# EAGLE design wt12_breakout_board_v30 (EAGLE 7.5.0)
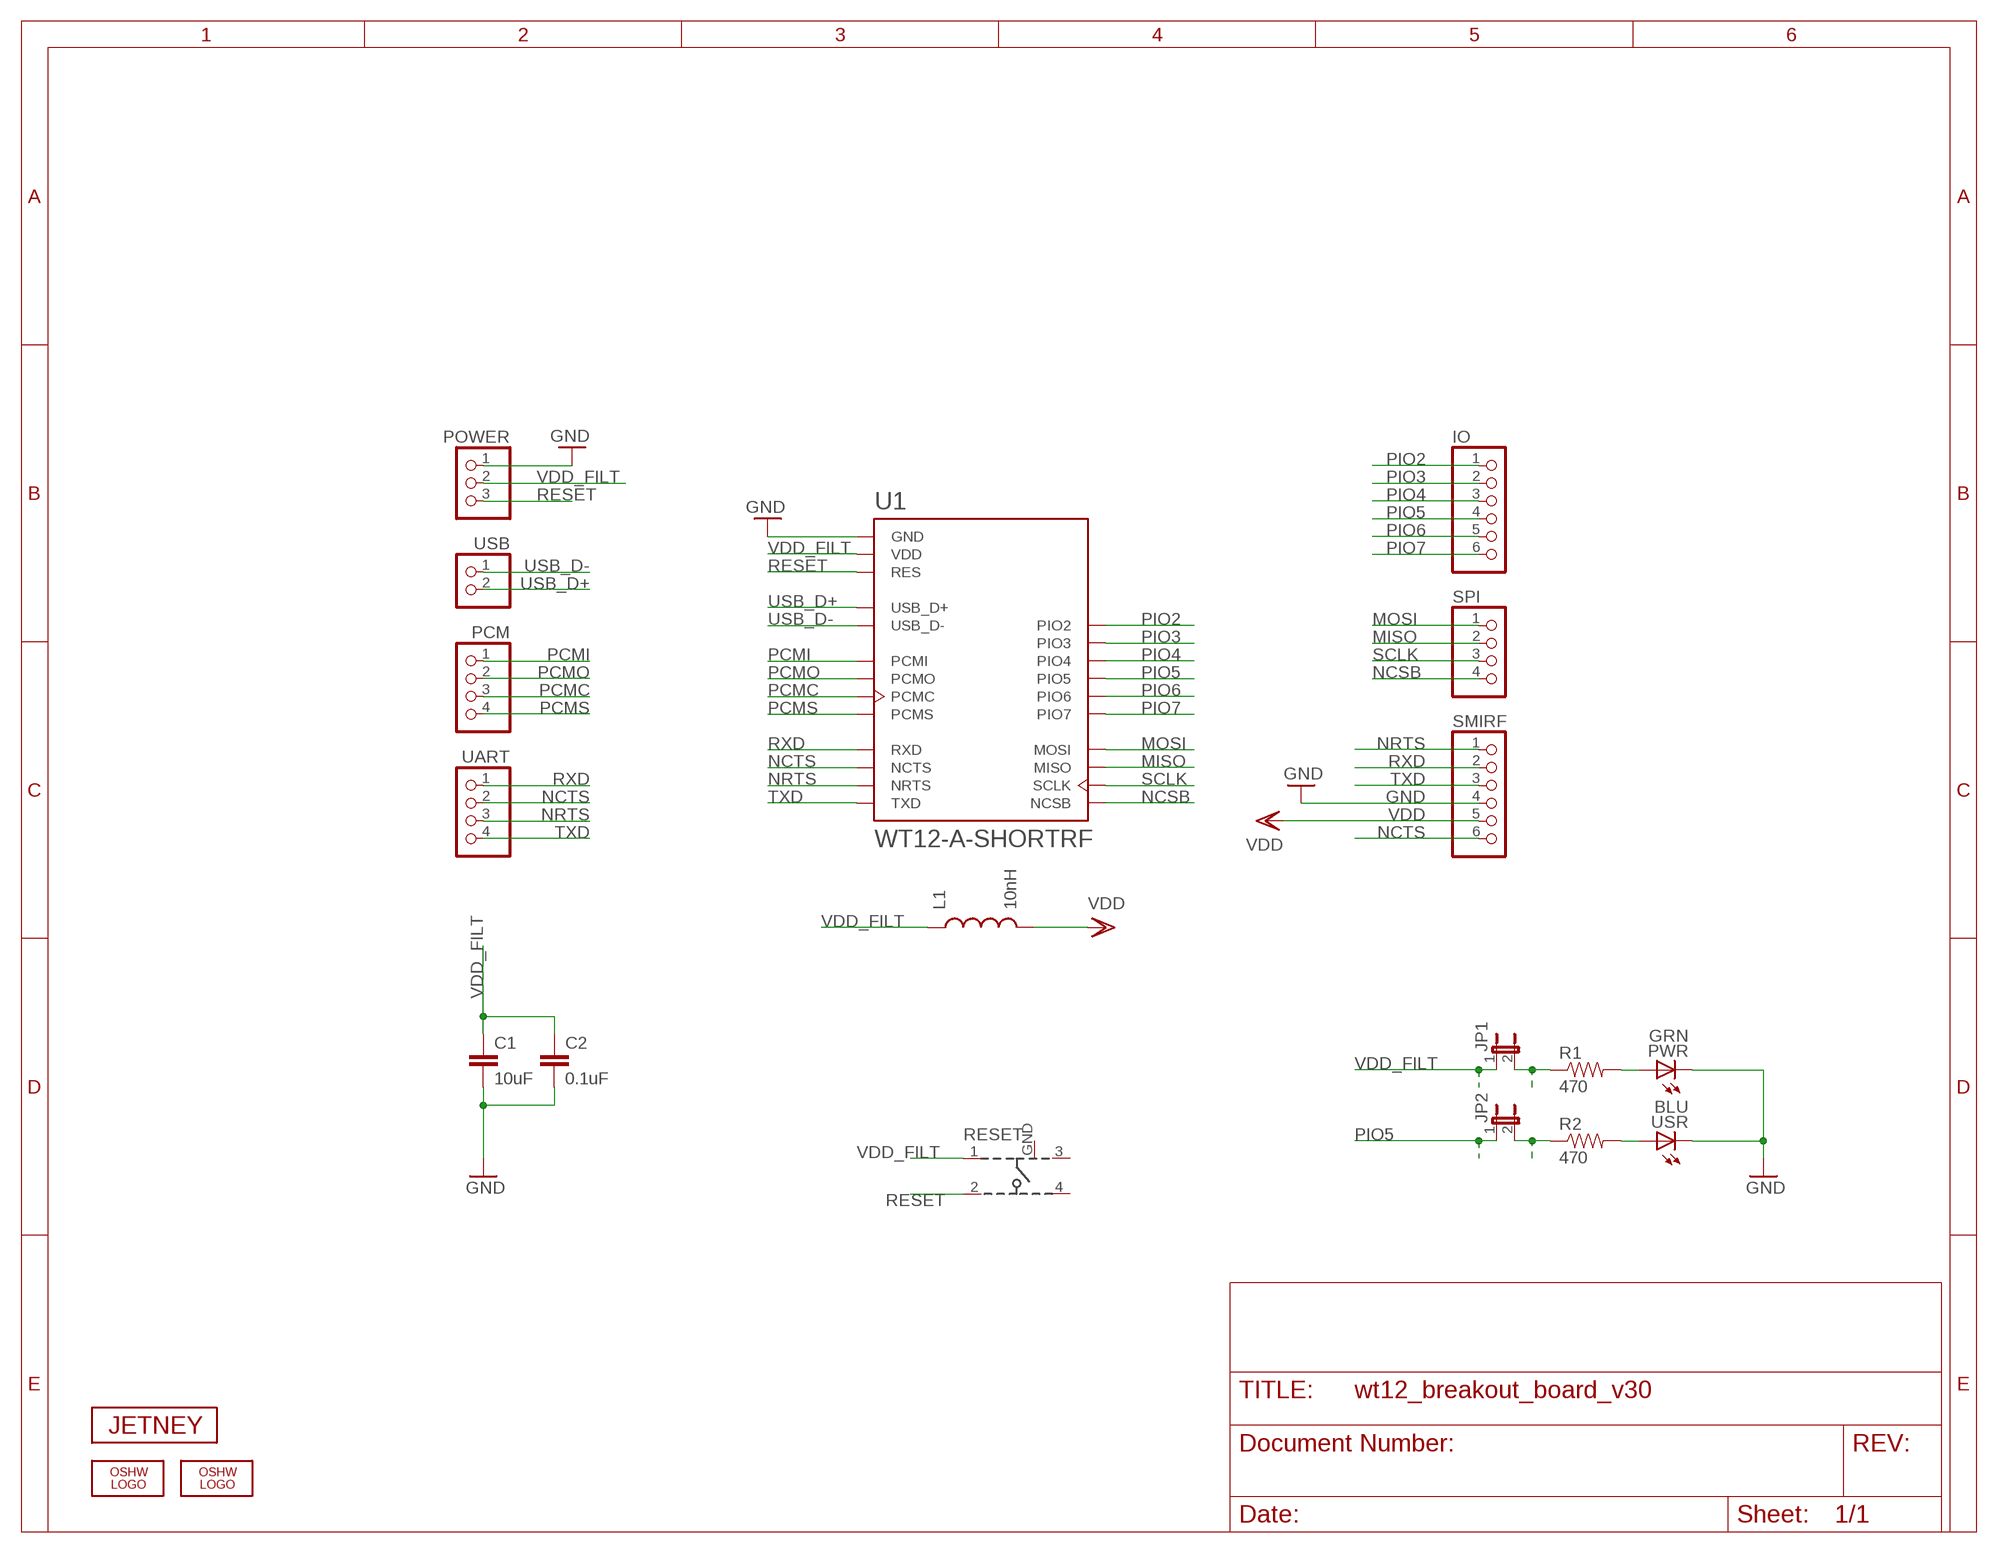
[diagram p0: schematic, sheet 1]

## Parts
C1  10uF  CAP0603-CAP  [0603-CAP]
C2  0.1uF  CAP0603-CAP  [0603-CAP]
IO  PINHD-1X6  [1X06]
JP1  JUMPER-2SMD-NC  [SJ_2S]
JP2  JUMPER-2SMD-NC  [SJ_2S]
L1  10nH  INDUCTOR0603  [0603]
LOGO1  OSHW_LOGO_FILLX0070-NT  [OSHW_FILLX70_NOTEXT]
LOGO3  OSHW_LOGO_FILLX0070-NT  [OSHW_FILLX70_NOTEXT]
PCM  PINHD-1X4  [1X04]
POWER  PINHD-1X3  [1X03]
PWR  GRN  LEDCHIPLED_0805  [CHIPLED_0805]
R1  470  RESISTOR0603-RES  [0603-RES]
R2  470  RESISTOR0603-RES  [0603-RES]
RESET  101-IG  [101-IG]
SMIRF  PINHD-1X6  [1X06]
SPI  PINHD-1X4  [1X04]
U1  WT12-A-SHORTRF  [WT12-A-SHORTRF]
U$2  JETNEY-LOGO-12  [JETNEY-LOGO-12]
UART  PINHD-1X4  [1X04]
USB  PINHD-1X2  [1X02]
USR  BLU  LEDCHIPLED_0805  [CHIPLED_0805]

## Nets
GND [power]: C1.2 C2.2 POWER.1 PWR.C SMIRF.4 U1.GND U1.GND@2(GND) U1.GND@3(GND) U1.GND@4(GND) USR.C
MISO: SPI.2 U1.MISO
MOSI: SPI.1 U1.MOSI
N$1: PWR.A R1.2
N$3: R2.2 USR.A
N$4: JP2.2 R2.1
NCSB: SPI.4 U1.NCSB
NCTS: SMIRF.6 U1.NCTS UART.2
NRTS: SMIRF.1 U1.NRTS UART.3
PCMC: PCM.3 U1.PCMC
PCMI: PCM.1 U1.PCMI
PCMO: PCM.2 U1.PCMO
PCMS: PCM.4 U1.PCMS
PIO2: IO.1 U1.PIO2
PIO3: IO.2 U1.PIO3
PIO4: IO.3 U1.PIO4
PIO5: IO.4 JP2.1 U1.PIO5
PIO6: IO.5 U1.PIO6
PIO7: IO.6 U1.PIO7
RESET: POWER.3 RESET.2 U1.RES
RXD: SMIRF.2 U1.RXD UART.1
SCLK: SPI.3 U1.SCLK
TXD: SMIRF.3 U1.TXD UART.4
USB_D+: U1.USB_D+ USB.2
USB_D-: U1.USB_D- USB.1
VDD [power]: L1.2 SMIRF.5
VDD_FILT [power]: C1.1 C2.1 JP1.1 L1.1 POWER.2 RESET.1 U1.VDD U1.VDD@2(VDD)
VDDJP1 [power]: JP1.2 R1.1
Unconnected: RESET.3 RESET.4

## Power pins joined to a net without a drawn wire
GND: RESET.GND

## Library data of the parts
C1 C2 = SparkFun:CAP: Capacitor Standard 0603 ceramic capacitor, and 0.1" leaded capacitor.
IO SMIRF = sf-pinhead:PINHD-1X6: PIN HEADER
JP1 JP2 = SparkFun:JUMPER-2: Jumper Basic 0.1" spaced jumper. Use with breakaway headers.
L1 = SparkFun:INDUCTOR: Inductors Basic Inductor/Choke - 0603 and 1206. Footprints are not proven and vary greatly between part numbers.
LOGO1 LOGO3 = oshw-logo:OSHW_LOGO_FILL
PCM SPI UART = sf-pinhead:PINHD-1X4: PIN HEADER
POWER = sf-pinhead:PINHD-1X3: PIN HEADER
PWR USR = adafruit:LED: LED OSRAM: - CHIPLED LG R971, LG N971, LY N971, LG Q971, LY Q971, LO R971, LY R971 LH N974, LH R974 LS Q976, LO Q976, LY Q976 LO Q996 - Hyper CHIPLED LW Q18S LB Q993, LB Q99A, LB R99A - SideLED LS A670, LO A670, LY A670, LG A670, LP A670 LB A673, LV A673, LT A673, LW A673 LH A674 LY A675 LS A676, LA A676, LO A676, LY A676, LW A676 LS A679, LY A679, LG A679 - Hyper Micro SIDELED® LS Y876, LA Y876, LO Y876, LY Y876 LT Y87S - SmartLED LW L88C, LW L88S LB L89C, LB L89S, LG L890 LS L89K, LO L89K, LY L89K LS L896, LA L896, LO L896, LY L896 - TOPLED LS T670, LO T670, LY T670, LG T670, LP T670 LSG T670, LSP T670, LSY T670, LOP T670, LYG T670 LG T671, LOG T671, LSG T671 LB T673, LV T673, LT T673, LW T673 LH T674 LS T676, LA T676, LO T676, LY T676, LB T676, LH T676, LSB T676, LW T676 LB T67C, LV T67C, LT T67C, LS T67K, LO T67K, LY T67K, LW E67C LS E67B, LA E67B, LO E67B, LY E67B, LB E67C, LV E67C, LT E67C LW T67C LS T679, LY T679, LG T679 LS T770, LO T770, LY T770, LG T770, LP T770 LB T773, LV T773, LT T773, LW T773 LH T774 LS E675, LA E675, LY E675, LS T675 LS T776, LA T776, LO T776, LY T776, LB T776 LHGB T686 LT T68C, LB T68C - Hyper Mini TOPLED® LB M676 - Mini TOPLED Santana® LG M470 LS M47K, LO M47K, LY M47K Source: http://www.osram.convergy.de/
R1 R2 = SparkFun:RESISTOR: Resistor Basic schematic elements and footprints for 0603, 1206, and PTH resistors.
RESET = sf-keyglove:101-IG
U1 = jetney-silabs-modules:WT12: Bluegiga WT12 class 2 Bluetooth 2.1 + EDR module. WT12-A variant has an on-module ceramic chip antenna. WT12-A variant includes keepout/restrict area. Antenna edge of the module should be flush up against the edge of the PCB. See datasheet for variant layout details. The WT12 is a fully integrated Bluetooth 2.1 + EDR, class 2 module combining antenna, Bluetooth radio, and an on-board iWRAP Bluetooth stack. Bluegiga's WT12 constitutes the ideal solution for developers that want to quickly integrate Bluetooth wireless technology into their design without investing several months in Bluetooth radio and stack development. It uses Bluegiga's iWRAP Bluetooth stack, which is an embedded Bluetooth stack implementing 13 different Bluetooth profiles and Apple iAP connectivity. The WT12 combined with iWRAP Bluetooth stack and Bluegiga's excellent technical support designers ensure quick time-to-market and low development costs and risks. http://www.bluegiga.com/en-US/products/bluetooth-classic-modules/wt12-bluetooth--class-2-module https://github.com/jrowberg/sf-oshw Last updated 2014-01-04 by Jeff Rowberg <jeff@rowberg.net>; ANTENNA: On-module ceramic chip antenna
U$2 = sf-keyglove:JETNEY-LOGO
USB = sf-pinhead:PINHD-1X2: PIN HEADER

## Net classes
0 default: width 0.152 mm, drill 0.33 mm, clearance 0.152 mm
1 power: width 0.254 mm, drill 0.33 mm, clearance 0.152 mm

## Board
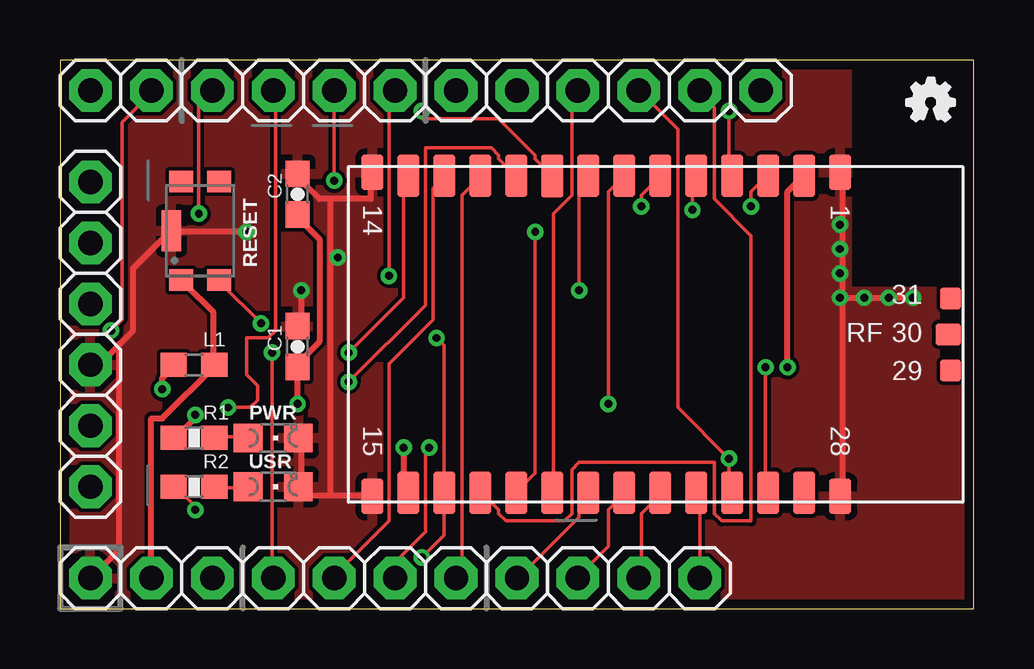
[diagram p1: board, top side]
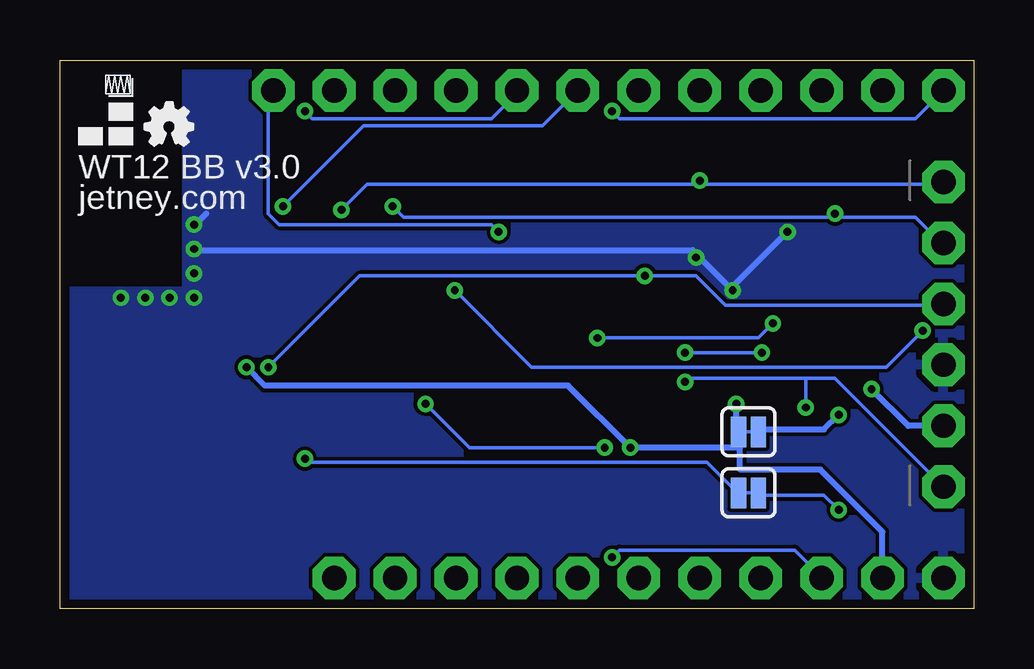
[diagram p2: board, bottom side, seen from below]

Size 38.1 x 22.86 mm. Coordinates in mm from the lower left corner, seen from the top.
Outline: 0,0 38.1,0 38.1,22.86 0,22.86 0,0
Copper layers (1*16): Top 0.0356mm / dielectric 1.5011mm / Bottom 0.0356mm
Design rules "LaenPCBOrder *": minimum track width 6mil, minimum drill 13mil, track to track 6mil, track to pad 6mil, pad to pad 6mil, via to via 6mil, smd to smd 6mil, copper to edge 15mil, drill to drill 6mil, minimum pad ring 7mil, minimum via ring 7mil, stop-mask expansion 4mil, vias tented up to drill 13mil, thermal gap 10mil
tRestrict: area 33,18.3 to 38.1,22.9
bRestrict: area 33,18.3 to 38.1,22.9
vRestrict: area 0,19.3 to 30.5,20.3; area 0,2.5 to 27.9,3.6; area 2.5,3.8 to 3.8,19.1; area 7.9,5.8 to 9.4,6.3; area 7.9,7.9 to 9.4,8.4; area 33,18.3 to 38.1,22.9

### Footprints (pad centres in the part's own frame; a part is rotated, then mirrored left to right if it is on the bottom)
0603-CAP = smd 1.1 x 1: 1 -0.85,0; 2 0.85,0
1X06 = drill 1.016 pad 1.778 octagon: 1 -6.35,0; 2 -3.81,0; 3 -1.27,0; 4 1.27,0; 5 3.81,0; 6 6.35,0
SJ_2S = smd 0.635 x 1.27: 1 -0.412,0; 2 0.412,0
0603 = smd 1.1 x 1: 1 -0.85,0; 2 0.85,0
1X04 = drill 1.016 pad 1.778 octagon: 1 -3.81,0; 2 -1.27,0; 3 1.27,0; 4 3.81,0
1X03 = drill 1.016 pad 1.778 octagon: 1 -2.54,0; 2 0,0; 3 2.54,0
CHIPLED_0805 = smd 1.2 x 1.2: A 0,-1.05; C 0,1.05
0603-RES = smd 1.1 x 1: 1 -0.85,0; 2 0.85,0
101-IG = smd 0.9 x 1: 1 -2.05,0.8; 2 -2.05,-0.8; 3 2.05,0.8; 4 2.05,-0.8 | smd 1.7 x 0.8: GND 0,1.2
WT12-A-SHORTRF = smd 1.478 x 0.914: GND -6.75,7.7; GND@2 -6.75,-11.8; GND@3 6.75,-11.8; GND@4 6.75,7.7 | smd 1.778 x 0.914: MISO 6.6,0.2; MOSI 6.6,1.7; NC 6.6,6.2; NCSB 6.6,-2.8; NCTS -6.6,-5.8; NRTS -6.6,1.7; PCMC -6.6,-8.8; PCMI -6.6,-7.3; PCMO -6.6,-1.3; PCMS -6.6,-10.3; PIO2 -6.6,4.7; PIO3 -6.6,3.2; PIO4 6.6,-4.3; PIO5 6.6,3.2; PIO6 6.6,-7.3; PIO7 6.6,-5.8; RES 6.6,-8.8; RXD -6.6,0.2; SCLK 6.6,-1.3; TXD 6.6,4.7; USB_D+ -6.6,-2.8; USB_D- -6.6,-4.3; VDD -6.6,6.2; VDD@2 6.6,-10.3 | smd 0.914 x 1.078: RF 0,12.2 | smd 0.914 x 0.878: RFGND 1.5,12.3; RFGND@2 -1.5,12.3
1X02 = drill 1.016 pad 1.778 octagon: 1 -1.27,0; 2 1.27,0

### Placement (x,y rotation side)
C1  9.91,10.92 90 top
C2  9.91,17.27 90 top
IO  22.86,21.59 0 top
JP1  9.4,7.37 0 bottom
JP2  9.4,4.83 0 bottom
L1  5.59,10.16 180 top
LOGO1  35.31,20.32 0 top
LOGO3  34.54,19.3 0 bottom
PCM  12.7,1.27 180 top
POWER  3.81,1.27 0 top
PWR  8.89,7.11 270 top
R1  5.59,7.11 0 top
R2  5.59,5.08 0 top
RESET  5.84,15.75 90 top
SMIRF  1.27,11.43 270 top
SPI  22.86,1.27 180 top
U1  24.83,11.43 270 top
U$2  37.34,19.3 0 bottom
UART  10.16,21.59 0 top
USB  2.54,21.59 0 top
USR  8.89,5.08 270 top

### Tracks (layer width: path | path; a pad name or v marks a point on that pad's centre or on a via)
GND  (via drill 0.33)
  Top 0.254: 32.61,18.14 32.61,16 | 32.61,16 32.61,14.94 | 32.61,14.94 32.61,13.87 | 32.61,13.87 32.61,12.95 | v35.56,12.95 v34.54,12.95 v33.53,12.95 32.61,12.95 | 32.61,13.87 v32.51,13.97 | 32.61,14.94 v32.51,14.99 | 32.61,16 v32.51,16 | 2.36,10.9 1.68,10.21 1.37,10.21 SMIRF.4 | 2.36,10.9 3.05,11.58 3.05,14.17 4.57,15.7 RESET.GND 4.72,15.7 v7.77,15.7 | POWER.1 2.44,2.44 2.44,10.82 2.36,10.9 | 11.28,17.07 12.95,17.07 12.95,18.14 | 11.28,17.07 10.82,17.07 9.91,17.98 C2.2 | PWR.C 10.06,7.01 10.06,5.18 USR.C 10.06,5.03 10.06,4.72 11.28,4.72 | 11.28,4.72 12.95,4.72 | 11.28,4.72 11.28,14.63 | 11.28,14.63 11.28,17.07 | v10.06,13.26 10.06,12.04 9.91,11.89 C1.2 | 32.61,12.95 32.61,4.72 | 32.61,12.95 v32.51,12.95 | v11.58,14.63 11.28,14.63
  Bottom 0.254: 32,16.46 32.46,16 v32.51,16 | 11.51,14.71 11.73,14.94 32.46,14.94 v32.51,14.99 | 11.51,14.71 v10.06,13.26 10.06,13.41 v7.77,15.7 | v11.58,14.63 11.51,14.71
  pour Top: 0,22.86 38.1,22.86 38.1,0 0,0
  pour Bottom: 0,22.86 38.1,22.86 38.1,0 0,0
MISO
  Top 0.152: SPI.2 24.23,1.37 24.23,3.96 24.99,4.72 24.99,4.83 U1.MISO
MOSI
  Top 0.152: SPI.1 26.67,4.72 26.53,4.72 U1.MOSI
N$1
  Top 0.152: R1.2 6.55,7.16 7.77,7.16 PWR.A
N$3
  Top 0.152: R2.2 6.55,5.03 7.77,5.03 USR.A
N$4  (via drill 0.33)
  Top 0.152: v5.64,4.12 5.64,4.27 4.88,5.03 R2.1
  Bottom 0.152: v5.64,4.12 6.25,4.72 8.84,4.72 JP2.2
N$5
  Bottom 0.152: 9.14,4.83 9.65,4.83
N$6
  Bottom 0.152: 9.14,7.37 9.65,7.37
NCSB
  Top 0.152: SPI.4 19.05,1.22 21.64,3.81 21.64,4.42 21.95,4.72 22.03,4.72 U1.NCSB
NCTS  (via drill 0.33)
  Top 0.152: v12.04,9.45 15.24,12.65 15.24,19.2 17.98,19.2 18.29,18.9 18.29,18.75 18.9,18.14 18.9,18.03 U1.NCTS | v7.01,8.38 7.92,8.38 8.23,8.69 8.23,9.3 7.77,9.75 7.77,11.28 8.69,11.28 8.99,11.58 8.99,21.49 UART.2
  Bottom 0.152: v12.04,9.45 11.89,9.6 7.01,9.6 | 7.01,9.6 5.79,9.6 SMIRF.6 | 7.01,9.6 v7.01,8.38
NRTS  (via drill 0.33)
  Top 0.152: v26.36,16.61 26.36,17.83 26.52,17.98 26.52,18.03 U1.NRTS | v11.43,17.83 UART.3
  Bottom 0.152: v26.36,16.61 25.3,17.68 11.43,17.68 | 11.43,17.68 1.37,17.68 SMIRF.1 | 11.43,17.68 v11.43,17.83
PCMC
  Top 0.152: PCM.3 11.43,1.37 13.72,3.66 13.72,10.21 15.54,12.04 15.54,17.53 16,17.98 16,18.03 U1.PCMC
PCMI
  Top 0.152: PCM.1 16.76,1.52 16.76,17.22 17.53,17.98 U1.PCMI
PCMO  (via drill 0.33)
  Top 0.152: v22.86,8.53 22.86,17.37 23.47,17.98 23.47,18.03 U1.PCMO | v15.39,6.71 15.24,6.55 15.24,3.2 14.02,1.98 14.02,1.37 PCM.2
  Bottom 0.152: v22.86,8.53 21.03,6.71 v15.39,6.71
PCMS  (via drill 0.33)
  Top 0.152: v12.04,10.67 14.33,12.95 14.33,17.83 14.48,17.98 14.53,17.98 U1.PCMS | v8.84,10.67 8.84,1.37 PCM.4
  Bottom 0.152: v8.84,10.67 v12.04,10.67
PIO2  (via drill 0.33)
  Top 0.152: v28.8,16.76 28.8,17.37 29.41,17.98 29.41,18.03 U1.PIO2
  Bottom 0.152: v28.8,16.76 25.45,20.12 17.98,20.12 IO.1
PIO3  (via drill 0.33)
  Top 0.152: v27.89,20.73 27.89,18.03 U1.PIO3
  Bottom 0.152: v27.89,20.73 27.58,20.42 20.12,20.42 19.05,21.49 IO.2
PIO4
  Top 0.152: IO.3 21.34,21.34 21.34,17.22 20.57,16.46 20.57,4.88 20.53,4.88 U1.PIO4
PIO5  (via drill 0.33)
  Top 0.152: IO.4 25.76,19.96 25.76,8.38 v27.89,6.25 27.89,4.83 U1.PIO5
  Bottom 0.152: v27.89,6.25 27.74,6.1 11.12,6.1 9.91,4.88 JP2.1
PIO6
  Top 0.152: IO.5 26.67,21.49 27.28,20.88 27.28,17.07 28.8,15.54 28.8,3.66 27.58,3.66 27.28,3.96 27.28,6.1 21.64,6.1 21.34,5.79 21.34,3.96 21.03,3.66 18.59,3.66 18.29,3.96 18.29,4.12 17.68,4.72 17.53,4.72 U1.PIO6
PIO7  (via drill 0.33)
  Top 0.152: v19.81,15.7 19.81,5.64 19.05,4.88 19.03,4.88 U1.PIO7
  Bottom 0.152: v19.81,15.7 20.12,16 28.96,16 29.41,16.46 29.41,21.49 29.26,21.49 IO.6
RESET  (via drill 0.33)
  Top 0.152: v8.38,11.89 6.71,13.56 RESET.2 | v15.7,11.28 16,10.97 16,4.88 16.03,4.88 U1.RES 16.03,4.72 16,4.72 16,3.05 v15.09,2.13
  Bottom 0.152: v8.38,11.89 8.99,11.28 v15.7,11.28 | v15.09,2.13 14.78,2.44 7.47,2.44 6.4,1.37 POWER.3
RXD  (via drill 0.33)
  Top 0.152: v24.23,16.76 24.23,17.22 24.99,17.98 25.03,17.98 U1.RXD | UART.1 5.79,21.03 v5.79,16.46
  Bottom 0.152: v24.23,16.76 23.77,16.31 5.79,16.31 | 5.79,16.31 2.44,16.31 1.37,15.24 SMIRF.2 | 5.79,16.31 v5.79,16.46
SCLK
  Top 0.152: SPI.3 21.64,1.37 22.86,2.59 22.86,4.12 23.47,4.72 23.47,4.83 U1.SCLK
TXD  (via drill 0.33)
  Top 0.152: v29.41,10.06 29.41,4.83 U1.TXD | UART.4 13.72,21.34 v13.72,13.87
  Bottom 0.152: v29.41,10.06 25.6,13.87 v13.72,13.87 11.58,13.87 10.36,12.65 1.37,12.65 SMIRF.3
USB_D+  (via drill 0.33)
  Top 0.152: v21.64,13.26 21.64,17.68 21.95,17.98 21.95,18.03 U1.USB_D+ | v2.13,11.58 2.59,12.04 2.59,20.27 3.81,21.49 USB.2
  Bottom 0.152: v21.64,13.26 18.44,10.06 3.66,10.06 v2.13,11.58
USB_D-  (via drill 0.33)
  Top 0.152: v15.09,20.73 15.09,20.42 18.29,20.42 19.81,18.9 19.81,18.75 20.42,18.14 20.53,18.14 U1.USB_D-
  Bottom 0.152: v15.09,20.73 14.78,20.42 2.44,20.42 USB.1
VDD  (via drill 0.33)
  Top 0.254: v4.27,9.14 4.27,9.6 4.72,10.06 L1.2
  Bottom 0.254: v4.27,9.14 2.74,7.62 SMIRF.5
VDD_FILT  (via drill 0.33)
  Top 0.254: C2.1 9.91,16.31 10.82,15.39 10.82,11.12 9.91,10.21 C1.1 v9.91,8.53 | RESET.1 5.18,13.56 6.4,12.34 6.4,10.21 L1.1 6.4,10.06 4.27,7.92 3.81,7.92 POWER.2 | v14.33,6.71 14.33,5.03 14.48,4.88 14.53,4.88 U1.VDD@2 | v30.33,10.06 30.33,17.37 30.94,17.98 31.03,17.98 U1.VDD
  Bottom 0.254: 9.75,6.71 9.75,5.79 6.4,5.79 3.81,3.2 POWER.2 | 9.75,6.71 9.75,7.32 JP1.1 9.91,7.47 v9.91,8.53 | 9.75,6.71 v14.33,6.71 16.92,9.3 29.57,9.3 v30.33,10.06
VDDJP1  (via drill 0.33)
  Top 0.254: v5.64,8.08 5.64,7.92 4.88,7.16 R1.1
  Bottom 0.254: v5.64,8.08 6.25,7.47 8.84,7.47 JP1.2

### Text on the board
bPlace: WT12 BB v3.0 | jetney.com
tDocu: D- D+ | RTS RXD TXD GND 3V3 CTS | RXD CTS RTS TXD | P2 P3 P4 P5 P6 P7 | Bluegiga / WT12-A | GND 3V3 RES SYN CLK OUT CSB SCK | IN | MISO | MOSI
bDocu: RTS RXD TXD GND 3V3 CTS | PWR | PIO5